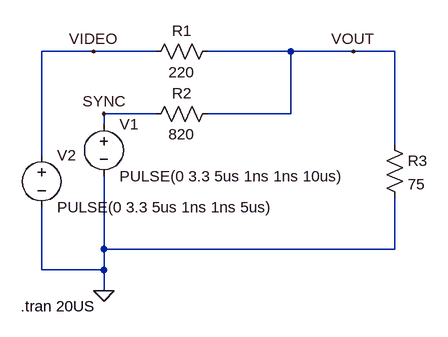
[diagram p0: schematic Draft1.asc]
Draft1.asc, the LTspice schematic file:
Version 4
SHEET 1 880 680
WIRE 64 96 -16 96
WIRE 160 96 64 96
WIRE 368 96 240 96
WIRE 464 96 368 96
WIRE 528 96 464 96
WIRE 160 192 80 192
WIRE 368 192 368 96
WIRE 368 192 240 192
WIRE 80 208 80 192
WIRE 528 240 528 96
WIRE -16 256 -16 96
WIRE 80 400 80 288
WIRE 528 400 528 320
WIRE 528 400 80 400
WIRE -16 432 -16 336
WIRE 80 432 80 400
WIRE 80 432 -16 432
WIRE 80 464 80 432
FLAG 80 464 0
FLAG 464 96 VOUT
FLAG 64 96 VIDEO
FLAG 80 192 SYNC
SYMBOL res 256 80 R90
WINDOW 0 0 56 VBottom 2
WINDOW 3 32 56 VTop 2
SYMATTR InstName R1
SYMATTR Value 220
SYMBOL res 256 176 R90
WINDOW 0 0 56 VBottom 2
WINDOW 3 32 56 VTop 2
SYMATTR InstName R2
SYMATTR Value 820
SYMBOL voltage 80 192 R0
WINDOW 123 0 0 Left 0
WINDOW 39 0 0 Left 0
SYMATTR InstName V1
SYMATTR Value PULSE(0 3.3 5us 1ns 1ns 10us)
SYMBOL voltage -16 240 R0
WINDOW 123 0 0 Left 0
WINDOW 39 0 0 Left 0
SYMATTR InstName V2
SYMATTR Value PULSE(0 3.3 5us 1ns 1ns 5us)
SYMBOL res 512 224 R0
SYMATTR InstName R3
SYMATTR Value 75
TEXT -48 488 Left 2 !.tran 20US

The netlist it stands for:
* Draft1.asc
R1 VOUT VIDEO 220
R2 VOUT SYNC 820
V1 SYNC 0 PULSE(0 3.3 5us 1ns 1ns 10us)
V2 VIDEO 0 PULSE(0 3.3 5us 1ns 1ns 5us)
R3 VOUT 0 75
.tran 20US
.backanno
.end

* Results of the author's LTspice run, read from the files saved beside the schematic
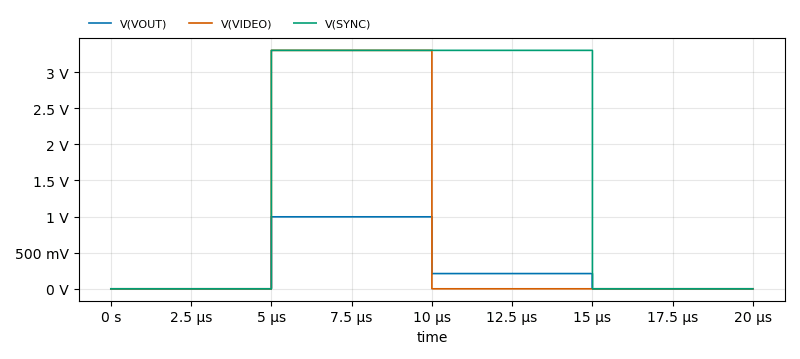
[diagram p1: Transient Analysis of Draft1.asc, plotted from the saved traces]
* Transient Analysis, 1 run:
*   V(VOUT): min 0 V, max 996.1 mV, average 301.8 mV, rms 509.1 mV, last 0 V
*   V(VIDEO): min 0 V, max 3.3 V, average 825.2 mV, rms 1.65 V, last 0 V
*   V(SYNC): min 0 V, max 3.3 V, average 1.65 V, rms 2.334 V, last 0 V